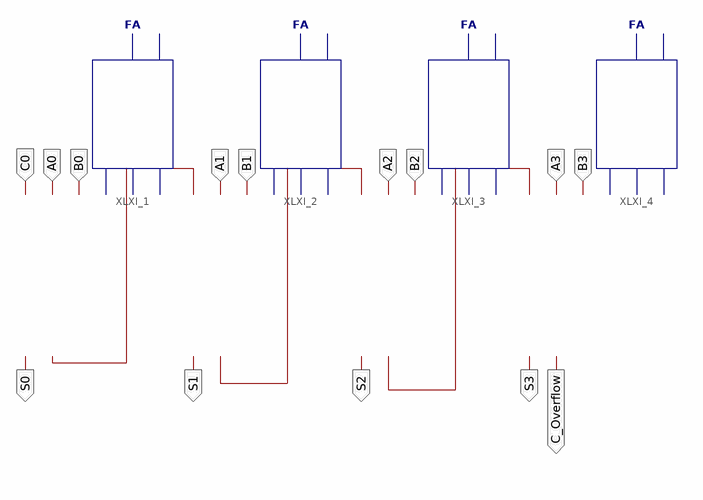
[diagram p0: schematic sheet 1]
// Xilinx ISE schematic RCA_4.sch (spartan3e) as structural Verilog: 4 symbols, 14 ports
module RCA_4 (
  input  C0,
  input  A0,
  input  B0,
  input  A1,
  input  B1,
  input  A2,
  input  B2,
  input  A3,
  input  B3,
  output S0,
  output S1,
  output S2,
  output S3,
  output C_Overflow
);

  wire XLXN_1, XLXN_2, XLXN_3;

  FA XLXI_1 (.A(A0), .B(B0), .C_in(C0), .C_out(XLXN_1), .S(S0));
  FA XLXI_2 (.A(A1), .B(B1), .C_in(XLXN_1), .C_out(XLXN_2), .S(S1));
  FA XLXI_3 (.A(A2), .B(B2), .C_in(XLXN_2), .C_out(XLXN_3), .S(S2));
  FA XLXI_4 (.A(A3), .B(B3), .C_in(XLXN_3), .C_out(C_Overflow), .S(S3));
endmodule
